# EasyEDA schematic 4.15.json
TITLE: Sheet_1; REV: 1.0; Date: 2020-11-17; Sheet: 1/1; Drawn By: Gökbey Keskin; Company: Your Company
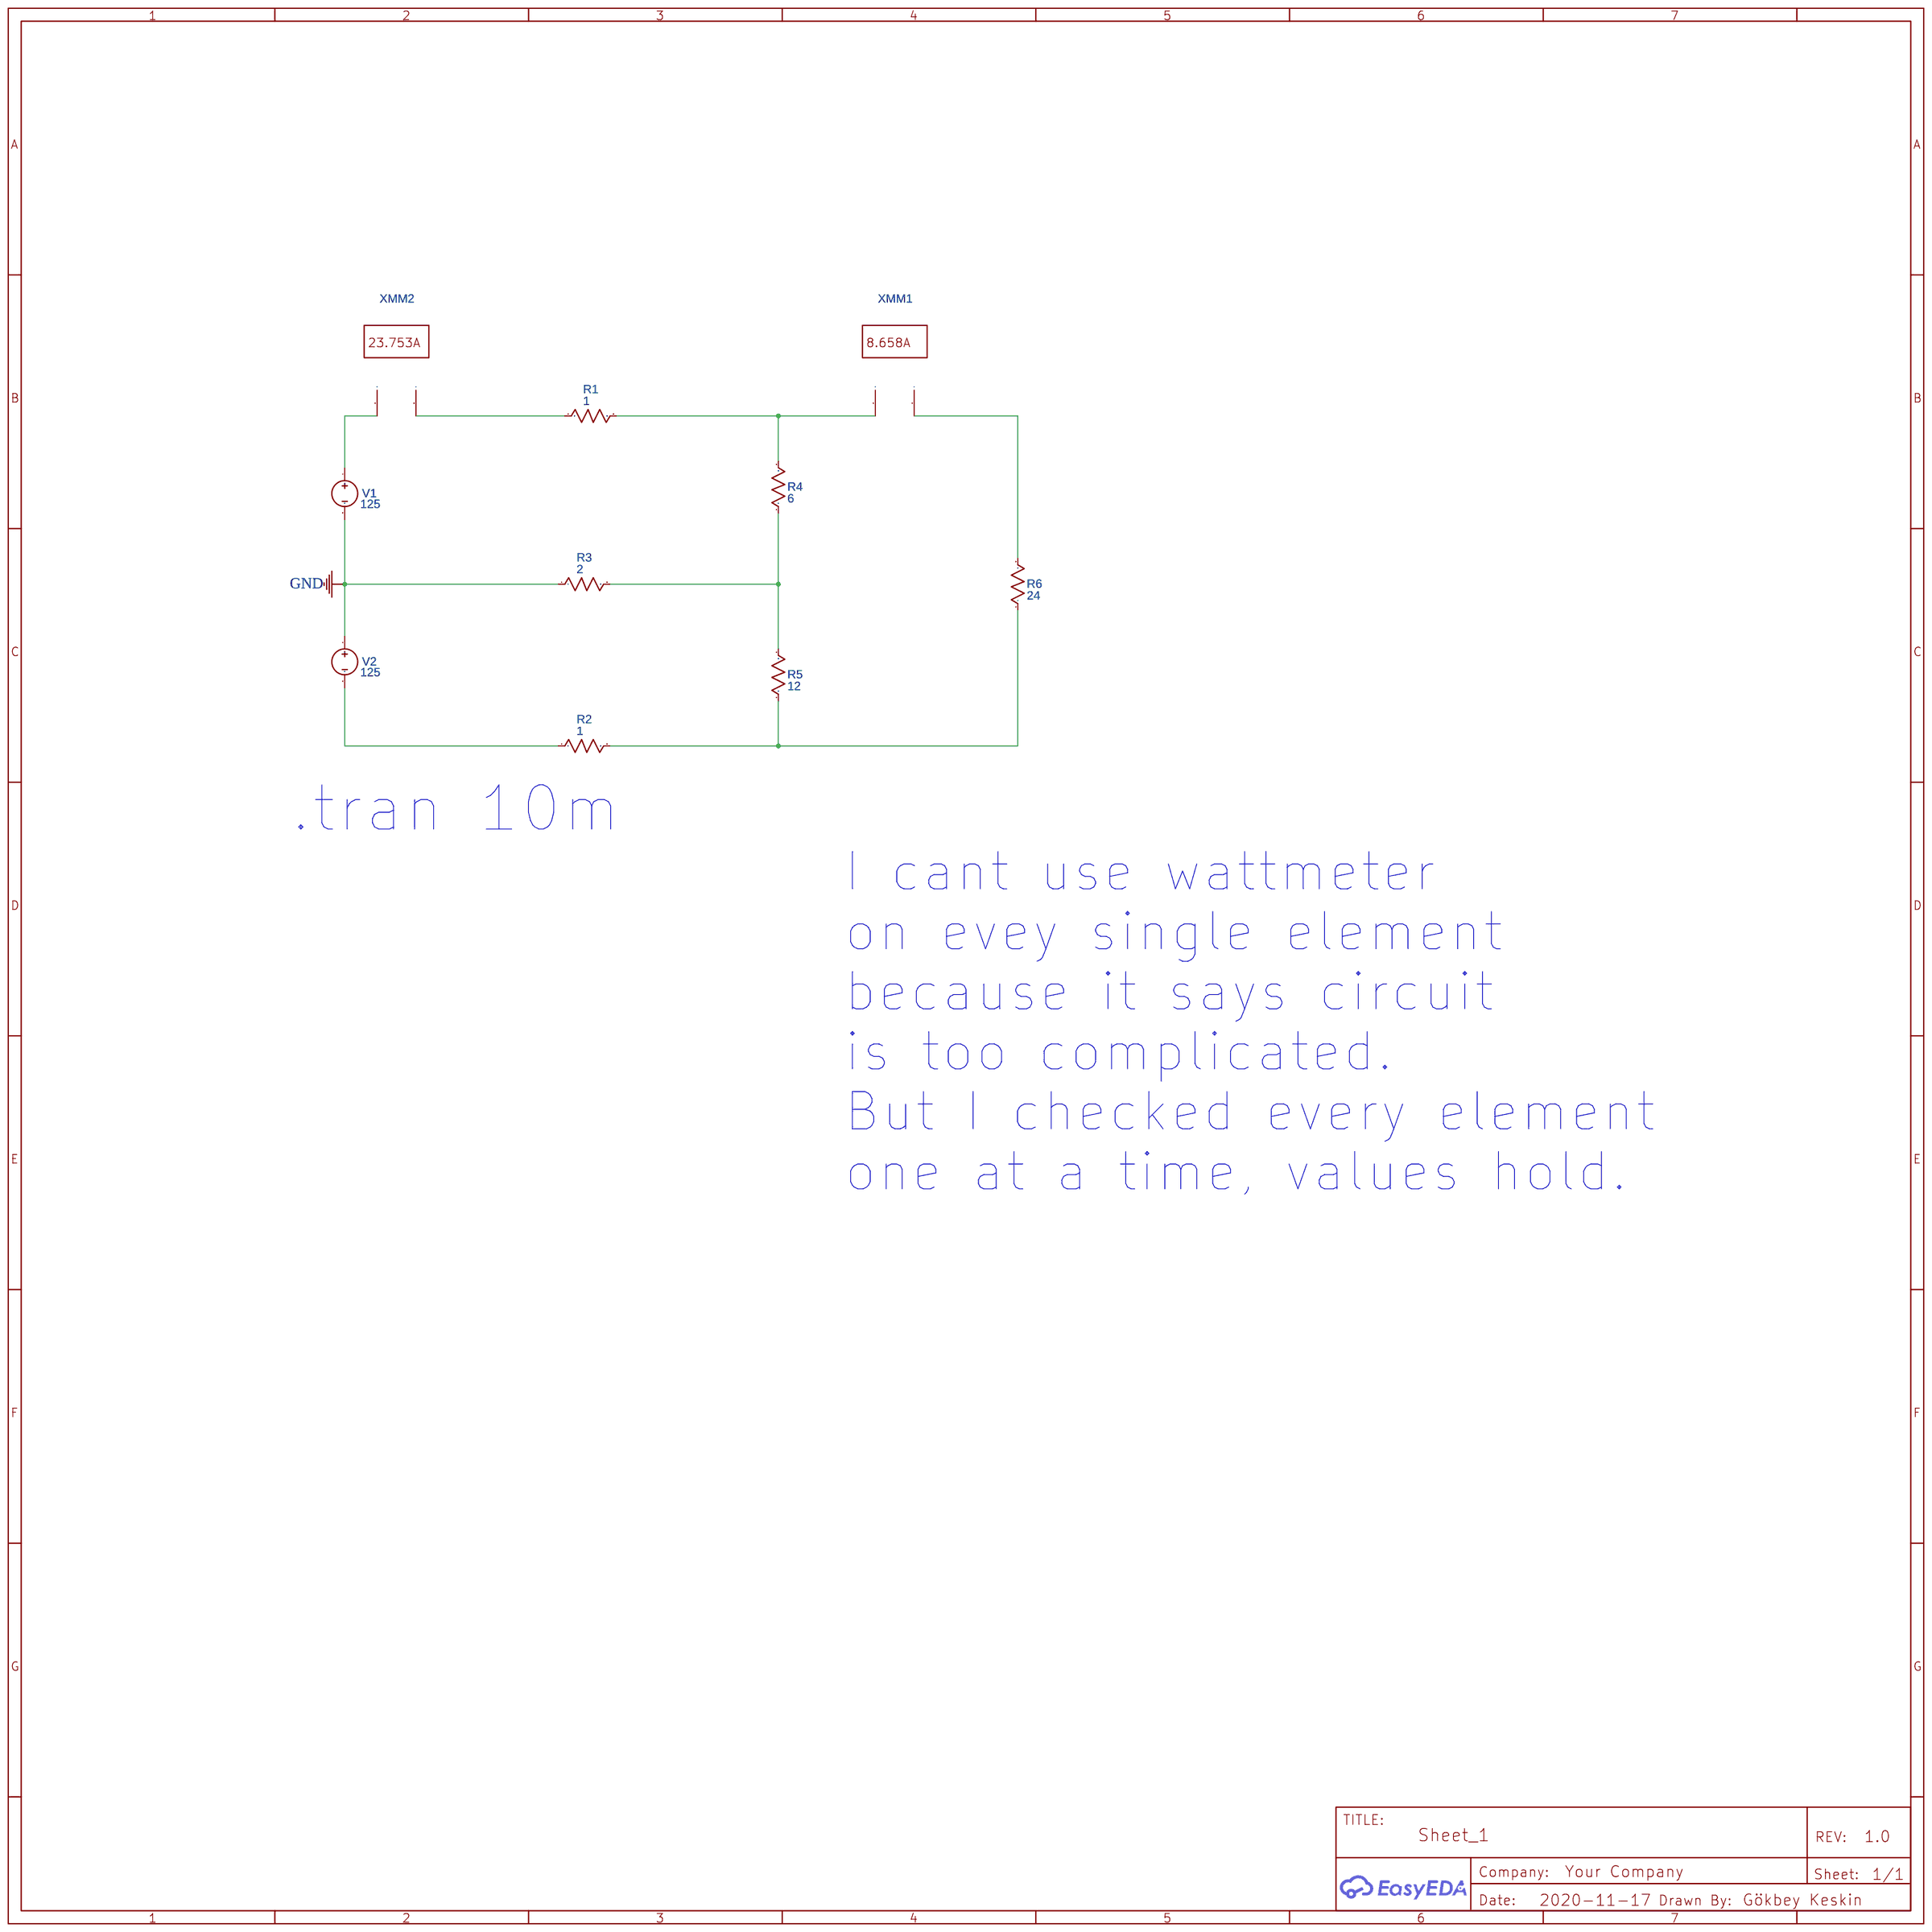
[diagram p0: schematic sheet]

## Parts
R1  1  [AXIAL-0.3]
R2  1  [AXIAL-0.3]
R3  2  [AXIAL-0.3]
R4  6  [AXIAL-0.3]
R5  12  [AXIAL-0.3]
R6  24  [AXIAL-0.3]
V1  125  [HDR1X2]
V2  125  [HDR1X2]
XMM1  Multimeter
XMM2  Multimeter

## Library data of the parts
R1-R6 = Resistor_US: Resistance: 1k; Contributor: EasyEDA; Supplier: YUJING
V1 V2 = VDC: Contributor: EasyEDA; sim: true
XMM1 XMM2 = MULTIMETER: Supplier: LCSC; Multimeter Type: Amper; Power Type: AC; Voltmeter resistance: 10μ; Ammeter resistance: 1G; NameDisplay: 0; Contributor: EasyEDA; sim: true

## Nets
GND: R3.1 V1.2 V2.1
Net-(R1-1): R1.1 XMM2.2(I)
Net-(R1-2): R1.2 R4.2 XMM1.1(+)
Net-(R2-1): R2.1 V2.2
Net-(R2-2): R2.2 R5.1 R6.1
Net-(R3-2): R3.2 R4.1 R5.2
Net-(R6-2): R6.2 XMM1.2(I)
Net-(V1-1): V1.1 XMM2.1(+)

## Notes on the sheet
- .tran 10m
- I cant use wattmeter
  on evey single element
  because it says circuit
  is too complicated.
  But I checked every element
  one at a time, values hold.
